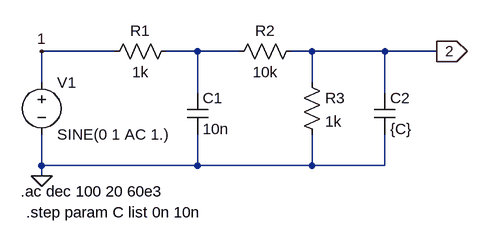
[diagram p0: schematic zvuk-lin-filtr.asc]
zvuk-lin-filtr.asc, the LTspice schematic file:
Version 4
SHEET 1 880 680
WIRE 32 80 -80 80
WIRE 160 80 112 80
WIRE 224 80 160 80
WIRE 336 80 304 80
WIRE 448 80 336 80
WIRE 528 80 448 80
WIRE -80 128 -80 80
WIRE 336 128 336 80
WIRE 160 144 160 80
WIRE 448 144 448 80
WIRE -80 256 -80 208
WIRE 160 256 160 208
WIRE 160 256 -80 256
WIRE 336 256 336 208
WIRE 336 256 160 256
WIRE 448 256 448 208
WIRE 448 256 336 256
WIRE -80 272 -80 256
FLAG -80 272 0
FLAG 528 80 2
IOPIN 528 80 Out
FLAG -80 80 1
SYMBOL res 128 64 R90
WINDOW 0 0 56 VBottom 2
WINDOW 3 32 56 VTop 2
SYMATTR InstName R1
SYMATTR Value 1k
SYMBOL res 320 64 R90
WINDOW 0 0 56 VBottom 2
WINDOW 3 32 56 VTop 2
SYMATTR InstName R2
SYMATTR Value 10k
SYMBOL res 320 112 R0
SYMATTR InstName R3
SYMATTR Value 1k
SYMBOL cap 144 144 R0
SYMATTR InstName C1
SYMATTR Value 10n
SYMBOL cap 432 144 R0
SYMATTR InstName C2
SYMATTR Value {C}
SYMBOL voltage -80 112 R0
WINDOW 123 0 0 Left 0
WINDOW 39 0 0 Left 0
SYMATTR InstName V1
SYMATTR Value SINE(0 1 AC 1.)
TEXT -112 296 Left 2 !.ac dec 100 20 60e3
TEXT -104 328 Left 2 !.step param C list 0n 10n

The netlist it stands for:
* zvuk-lin-filtr.asc
R1 N001 1 1k
R2 2 N001 10k
R3 2 0 1k
C1 N001 0 10n
C2 2 0 {C}
V1 1 0 SINE(0 1 AC 1.)
.ac dec 100 20 60e3
.step param C list 0n 10n
.backanno
.end